# Altium schematic sheet jeu_du_moulin_boura_LedMatrix_SCH.SchDoc
size A3; Organization: Ecole des Métiers de Fribourg; Address1: Ch. du Musée 2; Address2: 1700 Fribourg; Address3: Switzerland; SheetNumber: 3; SheetTotal: 3; BraceOpen: [; BraceClose: ]; Point: .
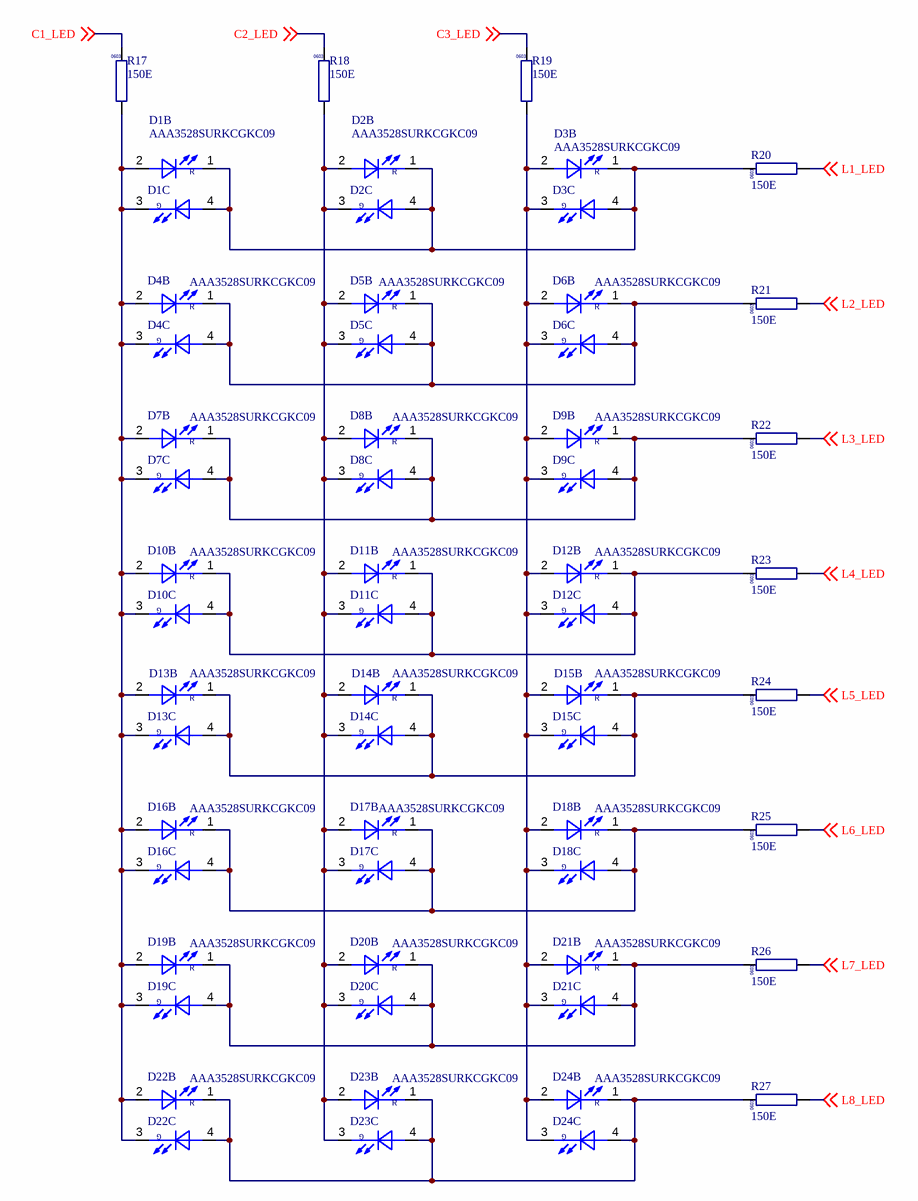
[diagram p0: jeu_du_moulin_boura_LedMatrix_SCH.SchDoc]

## Parts
D1  AAA3528SURKCGKC09  [TouchPAD-8mm+LED 4-SMD CIR]  (parts B,C of 3)
D2  AAA3528SURKCGKC09  [TouchPAD-8mm+LED 4-SMD CIR]  (parts B,C of 3)
D3  AAA3528SURKCGKC09  [TouchPAD-8mm+LED 4-SMD CIR]  (parts B,C of 3)
D4  AAA3528SURKCGKC09  [TouchPAD-8mm+LED 4-SMD CIR]  (parts B,C of 3)
D5  AAA3528SURKCGKC09  [TouchPAD-8mm+LED 4-SMD CIR]  (parts B,C of 3)
D6  AAA3528SURKCGKC09  [TouchPAD-8mm+LED 4-SMD CIR]  (parts B,C of 3)
D7  AAA3528SURKCGKC09  [TouchPAD-8mm+LED 4-SMD CIR]  (parts B,C of 3)
D8  AAA3528SURKCGKC09  [TouchPAD-8mm+LED 4-SMD CIR]  (parts B,C of 3)
D9  AAA3528SURKCGKC09  [TouchPAD-8mm+LED 4-SMD CIR]  (parts B,C of 3)
D10  AAA3528SURKCGKC09  [TouchPAD-8mm+LED 4-SMD CIR]  (parts B,C of 3)
D11  AAA3528SURKCGKC09  [TouchPAD-8mm+LED 4-SMD CIR]  (parts B,C of 3)
D12  AAA3528SURKCGKC09  [TouchPAD-8mm+LED 4-SMD CIR]  (parts B,C of 3)
D13  AAA3528SURKCGKC09  [TouchPAD-8mm+LED 4-SMD CIR]  (parts B,C of 3)
D14  AAA3528SURKCGKC09  [TouchPAD-8mm+LED 4-SMD CIR]  (parts B,C of 3)
D15  AAA3528SURKCGKC09  [TouchPAD-8mm+LED 4-SMD CIR]  (parts B,C of 3)
D16  AAA3528SURKCGKC09  [TouchPAD-8mm+LED 4-SMD CIR]  (parts B,C of 3)
D17  AAA3528SURKCGKC09  [TouchPAD-8mm+LED 4-SMD CIR]  (parts B,C of 3)
D18  AAA3528SURKCGKC09  [TouchPAD-8mm+LED 4-SMD CIR]  (parts B,C of 3)
D19  AAA3528SURKCGKC09  [TouchPAD-8mm+LED 4-SMD CIR]  (parts B,C of 3)
D20  AAA3528SURKCGKC09  [TouchPAD-8mm+LED 4-SMD CIR]  (parts B,C of 3)
D21  AAA3528SURKCGKC09  [TouchPAD-8mm+LED 4-SMD CIR]  (parts B,C of 3)
D22  AAA3528SURKCGKC09  [TouchPAD-8mm+LED 4-SMD CIR]  (parts B,C of 3)
D23  AAA3528SURKCGKC09  [TouchPAD-8mm+LED 4-SMD CIR]  (parts B,C of 3)
D24  AAA3528SURKCGKC09  [TouchPAD-8mm+LED 4-SMD CIR]  (parts B,C of 3)
R17  150E  [RSMD0603]
R18  150E  [RSMD0603]
R19  150E  [RSMD0603]
R20  150E  [RSMD0603]
R21  150E  [RSMD0603]
R22  150E  [RSMD0603]
R23  150E  [RSMD0603]
R24  150E  [RSMD0603]
R25  150E  [RSMD0603]
R26  150E  [RSMD0603]
R27  150E  [RSMD0603]

## Nets
C1_LED: R17.1 ; off-sheet C1_LED
C2_LED: R18.1 ; off-sheet C2_LED
C3_LED: R19.1 ; off-sheet C3_LED
L1_LED: R20.2 ; off-sheet L1_LED
L2_LED: R21.2 ; off-sheet L2_LED
L3_LED: R22.2 ; off-sheet L3_LED
L4_LED: R23.2 ; off-sheet L4_LED
L5_LED: R24.2 ; off-sheet L5_LED
L6_LED: R25.2 ; off-sheet L6_LED
L7_LED: R26.2 ; off-sheet L7_LED
L8_LED: R27.2 ; off-sheet L8_LED
NetD1_1: D1.1(CATHODE) D1.4(ANODE) D2.1(CATHODE) D2.4(ANODE) D3.1(CATHODE) D3.4(ANODE) R20.1
NetD1_2: D1.2(ANODE) D1.3(CATHODE) D4.2(ANODE) D4.3(CATHODE) D7.2(ANODE) D7.3(CATHODE) D10.2(ANODE) D10.3(CATHODE) D13.2(ANODE) D13.3(CATHODE) D16.2(ANODE) D16.3(CATHODE) D19.2(ANODE) D19.3(CATHODE) D22.2(ANODE) D22.3(CATHODE) R17.2
NetD2_2: D2.2(ANODE) D2.3(CATHODE) D5.2(ANODE) D5.3(CATHODE) D8.2(ANODE) D8.3(CATHODE) D11.2(ANODE) D11.3(CATHODE) D14.2(ANODE) D14.3(CATHODE) D17.2(ANODE) D17.3(CATHODE) D20.2(ANODE) D20.3(CATHODE) D23.2(ANODE) D23.3(CATHODE) R18.2
NetD3_2: D3.2(ANODE) D3.3(CATHODE) D6.2(ANODE) D6.3(CATHODE) D9.2(ANODE) D9.3(CATHODE) D12.2(ANODE) D12.3(CATHODE) D15.2(ANODE) D15.3(CATHODE) D18.2(ANODE) D18.3(CATHODE) D21.2(ANODE) D21.3(CATHODE) D24.2(ANODE) D24.3(CATHODE) R19.2
NetD4_1: D4.1(CATHODE) D4.4(ANODE) D5.1(CATHODE) D5.4(ANODE) D6.1(CATHODE) D6.4(ANODE) R21.1
NetD7_1: D7.1(CATHODE) D7.4(ANODE) D8.1(CATHODE) D8.4(ANODE) D9.1(CATHODE) D9.4(ANODE) R22.1
NetD10_1: D10.1(CATHODE) D10.4(ANODE) D11.1(CATHODE) D11.4(ANODE) D12.1(CATHODE) D12.4(ANODE) R23.1
NetD13_1: D13.1(CATHODE) D13.4(ANODE) D14.1(CATHODE) D14.4(ANODE) D15.1(CATHODE) D15.4(ANODE) R24.1
NetD16_1: D16.1(CATHODE) D16.4(ANODE) D17.1(CATHODE) D17.4(ANODE) D18.1(CATHODE) D18.4(ANODE) R25.1
NetD19_1: D19.1(CATHODE) D19.4(ANODE) D20.1(CATHODE) D20.4(ANODE) D21.1(CATHODE) D21.4(ANODE) R26.1
NetD22_1: D22.1(CATHODE) D22.4(ANODE) D23.1(CATHODE) D23.4(ANODE) D24.1(CATHODE) D24.4(ANODE) R27.1

## Notes on the sheet
- SECTION ELECTRONIQUE
- CH-1700 FRIBORURG
- SWITZERLAND
- ECOLE DES METIERS DE FRIBOURG
- Drawn by:
- Date:
- Checked by:
- Release:
- P/N:
- REV:
- Sheet
- of
- This drawing is confidential and may not be divulged in whole or in part to a third party
- (in symbol RSMD0603-04) 0603
- (in symbol TouchPAD-BILED4SMD, part B) R
- (in symbol TouchPAD-BILED4SMD, part C) G

## Library data of the parts
D1-D24 = TouchPAD-BILED4SMD
R17-R27 = RSMD0603-04: R SMD 150E  1% 60mW  CHIP 0603; Tol: 0.01; Stab(ppm): 100; EMF_PN: RSMD0603-04; Value: 150E; Type: RSMD-0603; Power: 60mW